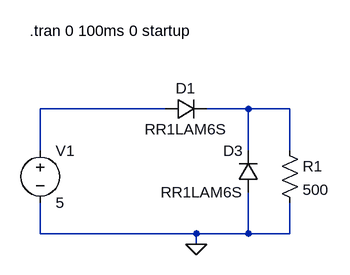
[diagram p0: schematic sim_2.asc]
sim_2.asc, the LTspice schematic file:
Version 4
SHEET 1 880 680
WIRE 160 96 -32 96
WIRE 288 96 224 96
WIRE 352 96 288 96
WIRE -32 160 -32 96
WIRE 288 160 288 96
WIRE 352 160 352 96
WIRE -32 288 -32 240
WIRE 208 288 -32 288
WIRE 288 288 288 224
WIRE 288 288 208 288
WIRE 352 288 352 240
WIRE 352 288 288 288
WIRE 208 304 208 288
FLAG 208 304 0
SYMBOL voltage -32 144 R0
WINDOW 123 0 0 Left 0
WINDOW 39 0 0 Left 0
SYMATTR InstName V1
SYMATTR Value 5
SYMBOL diode 160 112 R270
WINDOW 0 32 32 VTop 2
WINDOW 3 0 32 VBottom 2
SYMATTR InstName D1
SYMATTR Value RR1LAM6S
SYMBOL res 336 144 R0
SYMATTR InstName R1
SYMATTR Value 500
SYMBOL diode 304 224 R180
WINDOW 0 24 64 Left 2
WINDOW 3 24 0 Left 2
SYMATTR InstName D3
SYMATTR Value RR1LAM6S
TEXT -48 -24 Left 2 !.tran 0 100ms 0 startup

The netlist it stands for:
* sim_2.asc
V1 N001 0 5
D1 N001 N002 RR1LAM6S
R1 N002 0 500
D3 0 N002 RR1LAM6S
.model D D
.lib standard.dio
.tran 0 100ms 0 startup
.backanno
.end